# EAGLE schematic PCB - nrf52840 (EAGLE 9.6.2)
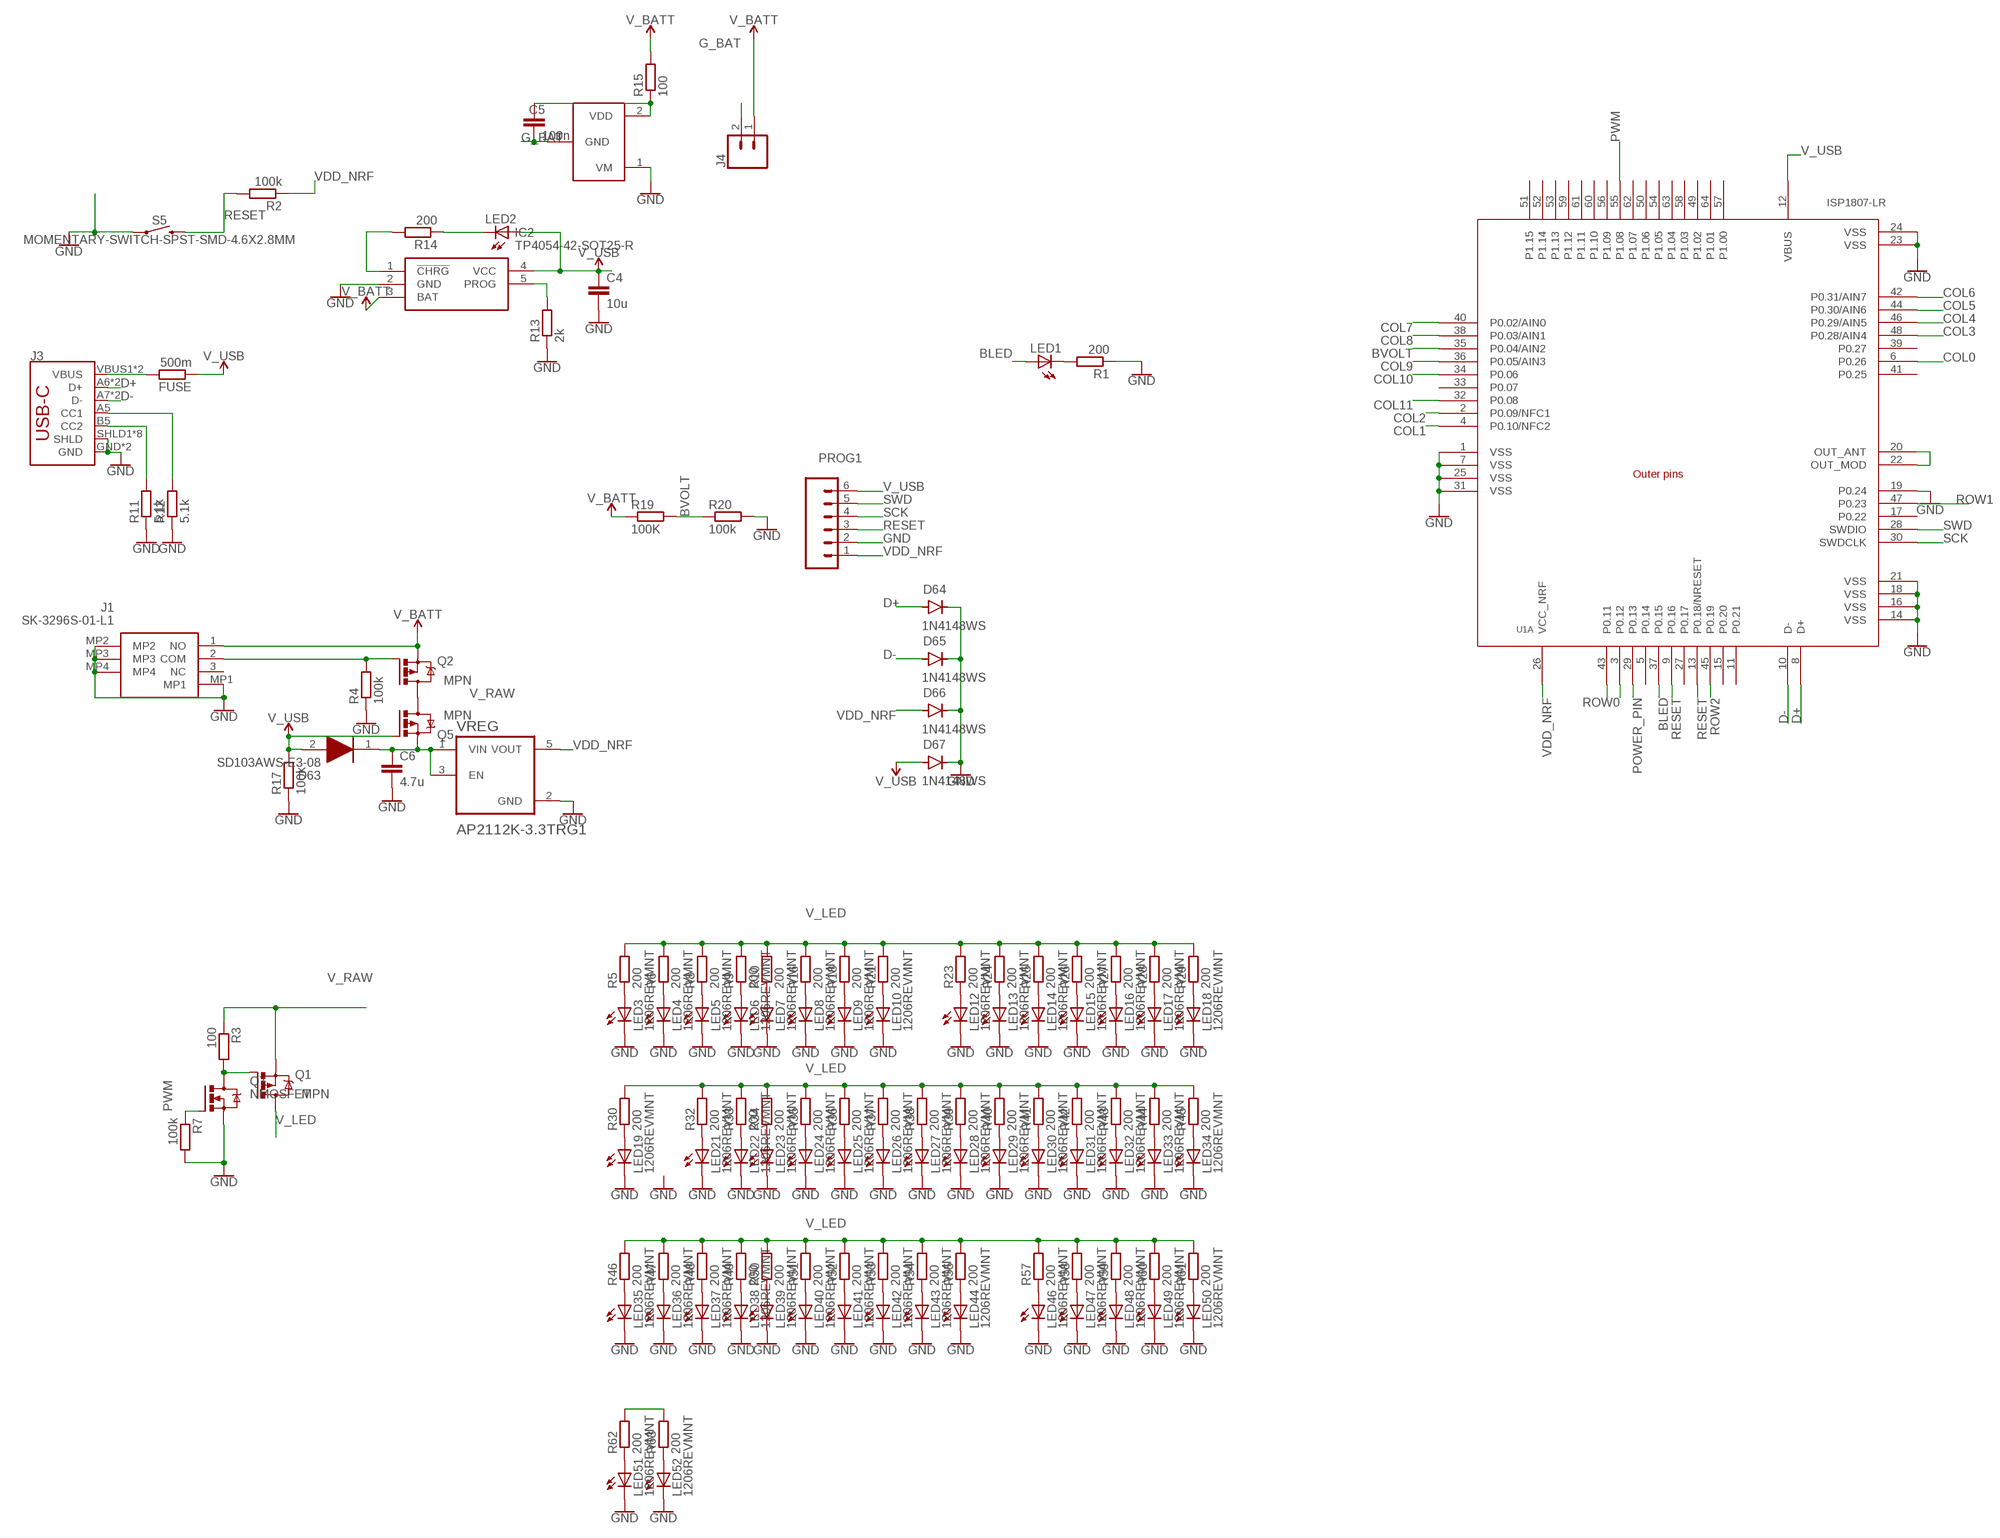
[diagram p0: schematic, sheet 1, part 1 of 2]
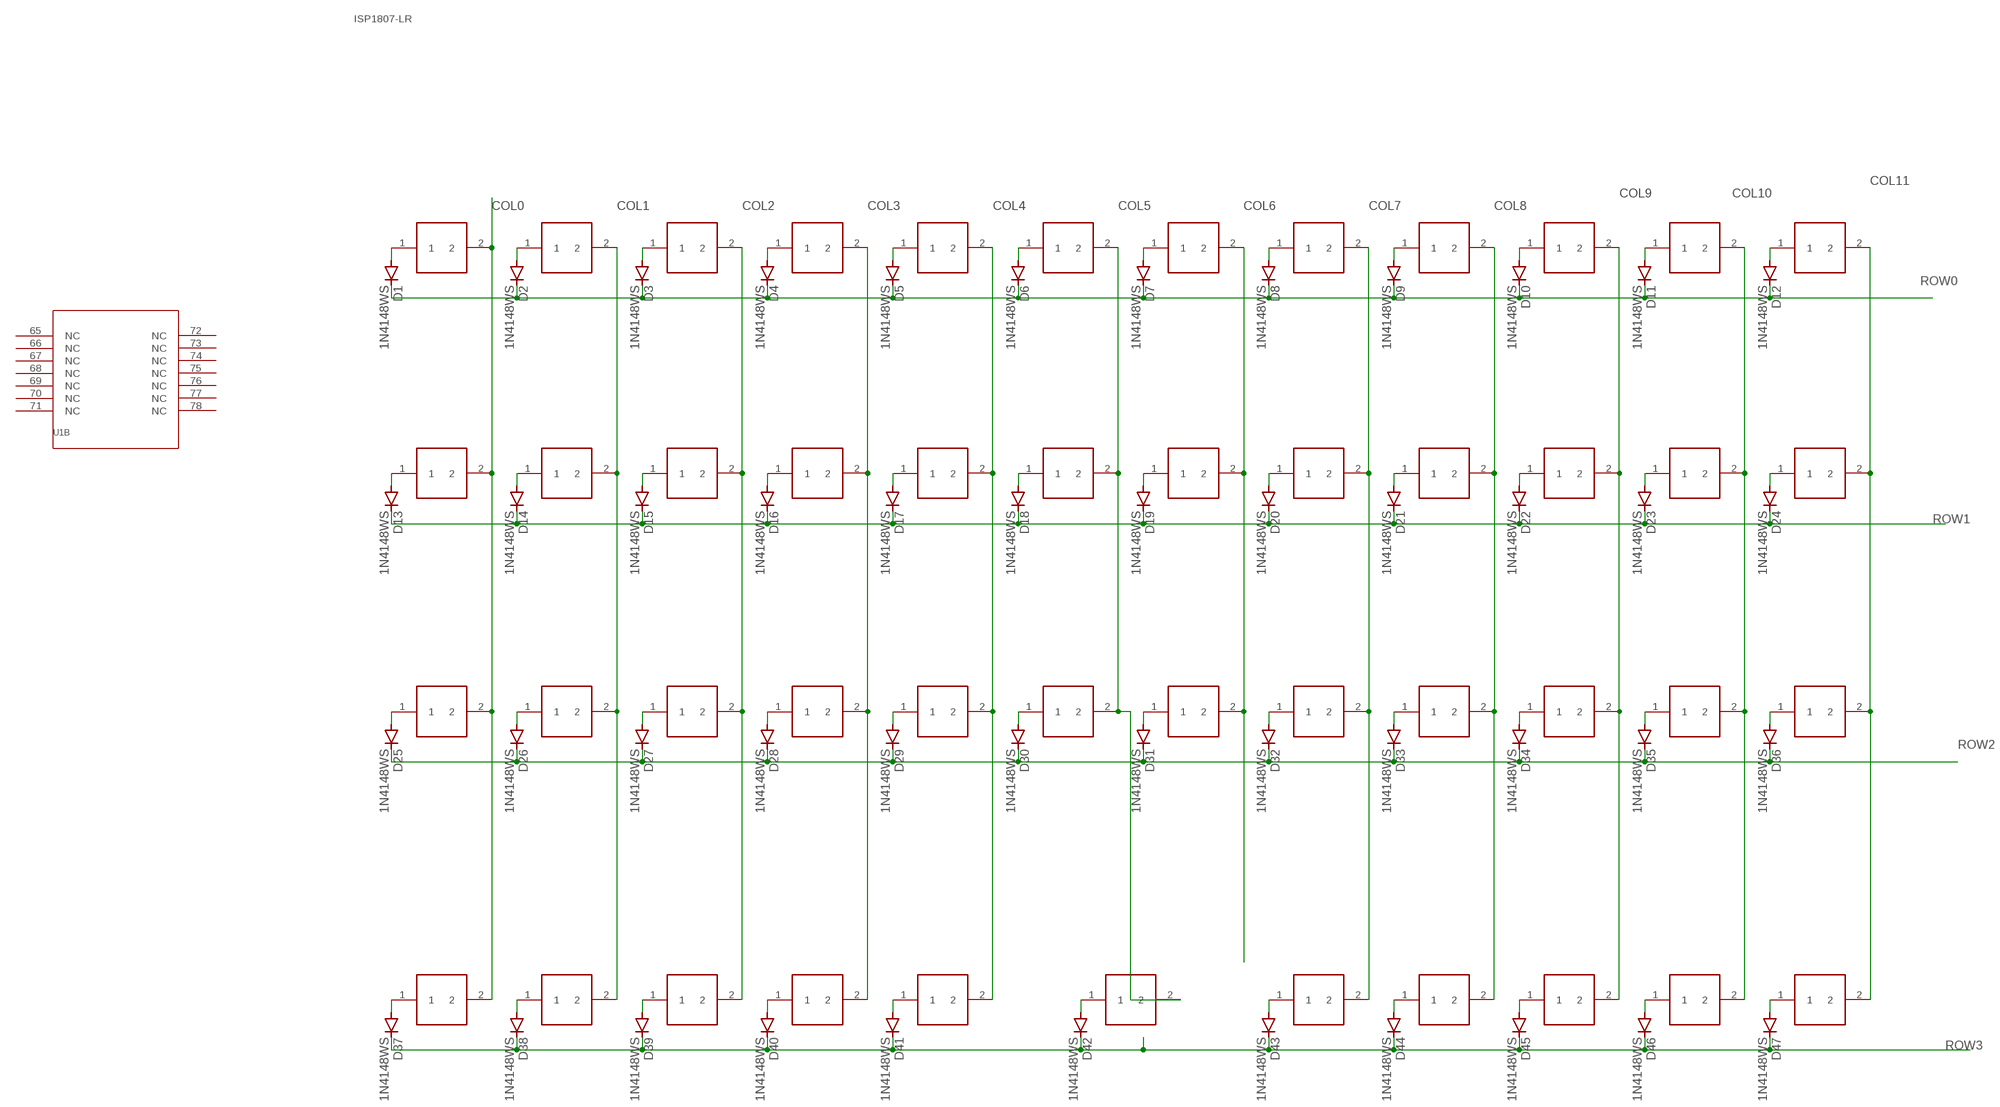
[diagram p1: schematic, sheet 1, part 2 of 2]

## Parts
5  CHERRYLOWPRO  [CHERRY-LOWPRO]
6  CHERRYLOWPRO  [CHERRY-LOWPRO]
7  CHERRYLOWPRO  [CHERRY-LOWPRO]
8  CHERRYLOWPRO  [CHERRY-LOWPRO]
12  CHERRYLOWPRO  [CHERRY-LOWPRO]
13  CHERRYLOWPRO  [CHERRY-LOWPRO]
14  CHERRYLOWPRO  [CHERRY-LOWPRO]
15  CHERRYLOWPRO  [CHERRY-LOWPRO]
16  CHERRYLOWPRO  [CHERRY-LOWPRO]
17  CHERRYLOWPRO  [CHERRY-LOWPRO]
18  CHERRYLOWPRO  [CHERRY-LOWPRO]
19  CHERRYLOWPRO  [CHERRY-LOWPRO]
21  CHERRYLOWPRO  [CHERRY-LOWPRO]
22  CHERRYLOWPRO  [CHERRY-LOWPRO]
23  CHERRYLOWPRO  [CHERRY-LOWPRO]
24  CHERRYLOWPRO  [CHERRY-LOWPRO]
25  CHERRYLOWPRO  [CHERRY-LOWPRO]
26  CHERRYLOWPRO  [CHERRY-LOWPRO]
27  CHERRYLOWPRO  [CHERRY-LOWPRO]
28  CHERRYLOWPRO  [CHERRY-LOWPRO]
29  CHERRYLOWPRO  [CHERRY-LOWPRO]
31  CHERRYLOWPRO  [CHERRY-LOWPRO]
32  CHERRYLOWPRO  [CHERRY-LOWPRO]
33  CHERRYLOWPRO  [CHERRY-LOWPRO]
34  CHERRYLOWPRO  [CHERRY-LOWPRO]
35  CHERRYLOWPRO  [CHERRY-LOWPRO]
36  CHERRYLOWPRO  [CHERRY-LOWPRO]
37  CHERRYLOWPRO  [CHERRY-LOWPRO]
38  CHERRYLOWPRO  [CHERRY-LOWPRO]
39  CHERRYLOWPRO  [CHERRY-LOWPRO]
42  CHERRYLOWPRO  [CHERRY-LOWPRO]
43  CHERRYLOWPRO  [CHERRY-LOWPRO]
44  CHERRYLOWPRO  [CHERRY-LOWPRO]
45  CHERRYLOWPRO  [CHERRY-LOWPRO]
46  CHERRYLOWPRO  [CHERRY-LOWPRO]
47  CHERRYLOWPRO  [CHERRY-LOWPRO]
48  CHERRYLOWPRO  [CHERRY-LOWPRO]
49  CHERRYLOWPRO  [CHERRY-LOWPRO]
110  CHERRYLOWPRO  [CHERRY-LOWPRO]
111  CHERRYLOWPRO  [CHERRY-LOWPRO]
210  CHERRYLOWPRO  [CHERRY-LOWPRO]
211  CHERRYLOWPRO  [CHERRY-LOWPRO]
212  CHERRYLOWPRO  [CHERRY-LOWPRO]
310  CHERRYLOWPRO  [CHERRY-LOWPRO]
311  CHERRYLOWPRO  [CHERRY-LOWPRO]
312  CHERRYLOWPRO  [CHERRY-LOWPRO]
410  CHERRYLOWPRO  [CHERRY-LOWPRO]
C4  10u  C-EUC0603  [C0603]
C5  100n  C-EUC0603  [C0603]
C6  4.7u  C-EUC0603  [C0603]
D1  1N4148WS  [SOD-323]
D2  1N4148WS  [SOD-323]
D3  1N4148WS  [SOD-323]
D4  1N4148WS  [SOD-323]
D5  1N4148WS  [SOD-323]
D6  1N4148WS  [SOD-323]
D7  1N4148WS  [SOD-323]
D8  1N4148WS  [SOD-323]
D9  1N4148WS  [SOD-323]
D10  1N4148WS  [SOD-323]
D11  1N4148WS  [SOD-323]
D12  1N4148WS  [SOD-323]
D13  1N4148WS  [SOD-323]
D14  1N4148WS  [SOD-323]
D15  1N4148WS  [SOD-323]
D16  1N4148WS  [SOD-323]
D17  1N4148WS  [SOD-323]
D18  1N4148WS  [SOD-323]
D19  1N4148WS  [SOD-323]
D20  1N4148WS  [SOD-323]
D21  1N4148WS  [SOD-323]
D22  1N4148WS  [SOD-323]
D23  1N4148WS  [SOD-323]
D24  1N4148WS  [SOD-323]
D25  1N4148WS  [SOD-323]
D26  1N4148WS  [SOD-323]
D27  1N4148WS  [SOD-323]
D28  1N4148WS  [SOD-323]
D29  1N4148WS  [SOD-323]
D30  1N4148WS  [SOD-323]
D31  1N4148WS  [SOD-323]
D32  1N4148WS  [SOD-323]
D33  1N4148WS  [SOD-323]
D34  1N4148WS  [SOD-323]
D35  1N4148WS  [SOD-323]
D36  1N4148WS  [SOD-323]
D37  1N4148WS  [SOD-323]
D38  1N4148WS  [SOD-323]
D39  1N4148WS  [SOD-323]
D40  1N4148WS  [SOD-323]
D41  1N4148WS  [SOD-323]
D42  1N4148WS  [SOD-323]
D43  1N4148WS  [SOD-323]
D44  1N4148WS  [SOD-323]
D45  1N4148WS  [SOD-323]
D46  1N4148WS  [SOD-323]
D47  1N4148WS  [SOD-323]
D63  SD103AWS-E3-08  [SOD2713X115N]
D64  1N4148WS  [SOD-323]
D65  1N4148WS  [SOD-323]
D66  1N4148WS  [SOD-323]
D67  1N4148WS  [SOD-323]
FUSE  500m  R-EU_R0603  [R0603]
IC1  XB3303ASOT23  [SOT23-3]
IC2  TP4054-42-SOT25-R  [SOT95P280X100-5N]
J1  SK-3296S-01-L1  [SK3296S01L1]
J3  SPARKFUN-CONNECTORS_USB_C16PIN  [SPARKFUN-CONNECTORS_USB-C-16P]
J4  CONN_02  [1X02]
LED1  LEDCHIPLED_0805  [CHIPLED_0805]
LED2  LEDCHIPLED_0805  [CHIPLED_0805]
LED3  1206REVMNT  [1206REVMNT]
LED4  1206REVMNT  [1206REVMNT]
LED5  1206REVMNT  [1206REVMNT]
LED6  1206REVMNT  [1206REVMNT]
LED7  1206REVMNT  [1206REVMNT]
LED8  1206REVMNT  [1206REVMNT]
LED9  1206REVMNT  [1206REVMNT]
LED10  1206REVMNT  [1206REVMNT]
LED12  1206REVMNT  [1206REVMNT]
LED13  1206REVMNT  [1206REVMNT]
LED14  1206REVMNT  [1206REVMNT]
LED15  1206REVMNT  [1206REVMNT]
LED16  1206REVMNT  [1206REVMNT]
LED17  1206REVMNT  [1206REVMNT]
LED18  1206REVMNT  [1206REVMNT]
LED19  1206REVMNT  [1206REVMNT]
LED21  1206REVMNT  [1206REVMNT]
LED22  1206REVMNT  [1206REVMNT]
LED23  1206REVMNT  [1206REVMNT]
LED24  1206REVMNT  [1206REVMNT]
LED25  1206REVMNT  [1206REVMNT]
LED26  1206REVMNT  [1206REVMNT]
LED27  1206REVMNT  [1206REVMNT]
LED28  1206REVMNT  [1206REVMNT]
LED29  1206REVMNT  [1206REVMNT]
LED30  1206REVMNT  [1206REVMNT]
LED31  1206REVMNT  [1206REVMNT]
LED32  1206REVMNT  [1206REVMNT]
LED33  1206REVMNT  [1206REVMNT]
LED34  1206REVMNT  [1206REVMNT]
LED35  1206REVMNT  [1206REVMNT]
LED36  1206REVMNT  [1206REVMNT]
LED37  1206REVMNT  [1206REVMNT]
LED38  1206REVMNT  [1206REVMNT]
LED39  1206REVMNT  [1206REVMNT]
LED40  1206REVMNT  [1206REVMNT]
LED41  1206REVMNT  [1206REVMNT]
LED42  1206REVMNT  [1206REVMNT]
LED43  1206REVMNT  [1206REVMNT]
LED44  1206REVMNT  [1206REVMNT]
LED46  1206REVMNT  [1206REVMNT]
LED47  1206REVMNT  [1206REVMNT]
LED48  1206REVMNT  [1206REVMNT]
LED49  1206REVMNT  [1206REVMNT]
LED50  1206REVMNT  [1206REVMNT]
LED51  1206REVMNT  [1206REVMNT]
LED52  1206REVMNT  [1206REVMNT]
PROG1  CONN_061.27MM  [1X06_1.27MM]
Q1  PMOSFET  PMOSFET_SOT23  [SOT23]
Q2  PMOSFET  PMOSFET_SOT23  [SOT23]
Q5  PMOSFET  PMOSFET_SOT23  [SOT23]
Q7  NMOSFET  NMOSFETSOT23  [SOT23]
R1  200  R-EU_R0603  [R0603]
R2  100k  R-EU_R0603  [R0603]
R3  100  R-EU_R0603  [R0603]
R4  100k  R-EU_R0603  [R0603]
R5  200  R-EU_R0603  [R0603]
R6  200  R-EU_R0603  [R0603]
R7  100k  R-EU_R0603  [R0603]
R8  200  R-EU_R0603  [R0603]
R9  200  R-EU_R0603  [R0603]
R10  200  R-EU_R0603  [R0603]
R11  5.1k  R-EU_R0603  [R0603]
R12  5.1k  R-EU_R0603  [R0603]
R13  2k  R-EU_R0603  [R0603]
R14  200  R-EU_R0603  [R0603]
R15  100  R-EU_R0603  [R0603]
R16  200  R-EU_R0603  [R0603]
R17  100k  R-EU_R0603  [R0603]
R18  200  R-EU_R0603  [R0603]
R19  100K  R-EU_R0603  [R0603]
R20  100k  R-EU_R0603  [R0603]
R21  200  R-EU_R0603  [R0603]
R23  200  R-EU_R0603  [R0603]
R24  200  R-EU_R0603  [R0603]
R25  200  R-EU_R0603  [R0603]
R26  200  R-EU_R0603  [R0603]
R27  200  R-EU_R0603  [R0603]
R28  200  R-EU_R0603  [R0603]
R29  200  R-EU_R0603  [R0603]
R30  200  R-EU_R0603  [R0603]
R32  200  R-EU_R0603  [R0603]
R33  200  R-EU_R0603  [R0603]
R34  200  R-EU_R0603  [R0603]
R35  200  R-EU_R0603  [R0603]
R36  200  R-EU_R0603  [R0603]
R37  200  R-EU_R0603  [R0603]
R38  200  R-EU_R0603  [R0603]
R39  200  R-EU_R0603  [R0603]
R40  200  R-EU_R0603  [R0603]
R41  200  R-EU_R0603  [R0603]
R42  200  R-EU_R0603  [R0603]
R43  200  R-EU_R0603  [R0603]
R44  200  R-EU_R0603  [R0603]
R45  200  R-EU_R0603  [R0603]
R46  200  R-EU_R0603  [R0603]
R47  200  R-EU_R0603  [R0603]
R48  200  R-EU_R0603  [R0603]
R49  200  R-EU_R0603  [R0603]
R50  200  R-EU_R0603  [R0603]
R51  200  R-EU_R0603  [R0603]
R52  200  R-EU_R0603  [R0603]
R53  200  R-EU_R0603  [R0603]
R54  200  R-EU_R0603  [R0603]
R55  200  R-EU_R0603  [R0603]
R57  200  R-EU_R0603  [R0603]
R58  200  R-EU_R0603  [R0603]
R59  200  R-EU_R0603  [R0603]
R60  200  R-EU_R0603  [R0603]
R61  200  R-EU_R0603  [R0603]
R62  200  R-EU_R0603  [R0603]
R63  200  R-EU_R0603  [R0603]
S5  MOMENTARY-SWITCH-SPST-SMD-4.6X2.8MM  [TACTILE_SWITCH_SMD_4.6X2.8MM]
U1  ISP1807-LRISP1807-LR_ISP1807-LR  [ISP1807-LR]
VREG  AP2112K-3.3TRG1  [SOT95P285X140-5N]

## Nets
BLED: LED1.A U1.37(A:P0.15)
BVOLT: R19.2 R20.1 U1.35(A:P0.04/AIN2)
COL0: 5.2 6.2 21.2 31.2 U1.6(A:P0.26)
COL1: 12.2 22.2 32.2 42.2 U1.4(A:P0.10/NFC2)
COL2: 13.2 23.2 33.2 43.2 U1.2(A:P0.09/NFC1)
COL3: 14.2 24.2 34.2 44.2 U1.48(A:P0.28/AIN4)
COL4: 15.2 25.2 35.2 45.2 U1.46(A:P0.29/AIN5)
COL5: 16.2 26.2 36.2 46.2 U1.44(A:P0.30/AIN6)
COL6: 17.2 27.2 37.2 U1.42(A:P0.31/AIN7)
COL7: 18.2 28.2 38.2 47.2 U1.40(A:P0.02/AIN0)
COL8: 19.2 29.2 39.2 48.2 U1.38(A:P0.03/AIN1)
COL9: 49.2 110.2 210.2 310.2 U1.36(A:P0.05/AIN3)
COL10: 111.2 211.2 311.2 410.2 U1.34(A:P0.06)
COL11: 7.2 8.2 212.2 312.2 U1.32(A:P0.08)
D+: D64.A J3.A6(D+) J3.B6(D+) U1.8(A:D+)
D-: D65.A J3.A7(D-) J3.B7(D-) U1.10(A:D-)
G_BAT: C5.2 IC1.3(GND) J4.2
GND: C4.2 C6.2 D64.C D65.C D66.C D67.C IC1.1(VM) IC2.2(GND) J1.MP1 J1.MP2 J1.MP3 J1.MP4 J3.GND J3.GND2(GND) J3.SHLD1(SHLD) J3.SHLD2(SHLD) J3.SHLD3(SHLD) J3.SHLD4(SHLD) J3.SHLD5(SHLD) J3.SHLD6(SHLD) J3.SHLD7(SHLD) J3.SHLD8(SHLD) LED3.2(C) LED4.2(C) LED5.2(C) LED6.2(C) LED7.2(C) LED8.2(C) LED9.2(C) LED10.2(C) LED12.2(C) LED13.2(C) LED14.2(C) LED15.2(C) LED16.2(C) LED17.2(C) LED18.2(C) LED19.2(C) LED21.2(C) LED22.2(C) LED23.2(C) LED24.2(C) LED25.2(C) LED26.2(C) LED27.2(C) LED28.2(C) LED29.2(C) LED30.2(C) LED31.2(C) LED32.2(C) LED33.2(C) LED34.2(C) LED35.2(C) LED36.2(C) LED37.2(C) LED38.2(C) LED39.2(C) LED40.2(C) LED41.2(C) LED42.2(C) LED43.2(C) LED44.2(C) LED46.2(C) LED47.2(C) LED48.2(C) LED49.2(C) LED50.2(C) LED51.2(C) LED52.2(C) PROG1.2 Q7.2(S) R1.1 R4.1 R7.2 R11.1 R12.1 R13.1 R17.1 R20.2 S5.1 S5.2 U1.1(A:VSS) U1.7(A:VSS) U1.14(A:VSS) U1.16(A:VSS) U1.18(A:VSS) U1.19(A:P0.24) U1.21(A:VSS) U1.23(A:VSS) U1.24(A:VSS) U1.25(A:VSS) U1.31(A:VSS) VREG.2(GND)
N$1: LED3.1(A) R5.1
N$2: 12.1 D2.A
N$3: 13.1 D3.A
N$4: 14.1 D4.A
N$5: 15.1 D5.A
N$6: 16.1 D6.A
N$7: 17.1 D7.A
N$8: 18.1 D8.A
N$9: 19.1 D9.A
N$10: 110.1 D10.A
N$11: 111.1 D11.A
N$12: 8.1 D12.A
N$13: 21.1 D13.A
N$14: 22.1 D14.A
N$15: 23.1 D15.A
N$16: 24.1 D16.A
N$17: 25.1 D17.A
N$18: 26.1 D18.A
N$19: 27.1 D19.A
N$20: 28.1 D20.A
N$21: 29.1 D21.A
N$22: 210.1 D22.A
N$23: 211.1 D23.A
N$24: 212.1 D24.A
N$25: 31.1 D25.A
N$26: 32.1 D26.A
N$27: 33.1 D27.A
N$28: 34.1 D28.A
N$29: 35.1 D29.A
N$30: 36.1 D30.A
N$31: 37.1 D31.A
N$32: 38.1 D32.A
N$33: 39.1 D33.A
N$34: 310.1 D34.A
N$35: 311.1 D35.A
N$36: 312.1 D36.A
N$37: LED4.1(A) R6.1
N$38: 42.1 D38.A
N$39: 43.1 D39.A
N$40: 44.1 D40.A
N$41: 45.1 D41.A
N$42: U1.20(A:OUT_ANT) U1.22(A:OUT_MOD)
N$43: 47.1 D43.A
N$44: 48.1 D44.A
N$45: 49.1 D45.A
N$46: 410.1 D46.A
N$47: 46.1 D42.A
N$48: 7.1 D47.A
N$49: 6.1 D37.A
N$50: LED1.C R1.2
N$51: LED5.1(A) R8.1
N$52: C5.1 IC1.2(VDD) R15.1
N$53: IC2.5(PROG) R13.2
N$54: LED6.1(A) R9.1
N$55: LED7.1(A) R10.1
N$56: LED8.1(A) R16.1
N$57: LED9.1(A) R18.1
N$58: LED10.1(A) R21.1
N$59: IC2.1(!CHRG) R14.2
N$60: LED2.C R14.1
N$61: Q2.3(D) Q5.3(D)
N$63: LED12.1(A) R23.1
N$64: LED13.1(A) R24.1
N$65: LED14.1(A) R25.1
N$66: LED15.1(A) R26.1
N$67: LED16.1(A) R27.1
N$68: 5.1 D1.A
N$69: LED17.1(A) R28.1
N$70: FUSE.2 J3.VBUS1(VBUS) J3.VBUS2(VBUS)
N$71: LED18.1(A) R29.1
N$72: J3.B5(CC2) R11.2
N$73: J3.A5(CC1) R12.2
N$74: LED19.1(A) R30.1
N$75: J1.2(COM) Q2.1(G) R4.2
N$77: Q1.1(G) Q7.3(D) R3.2
N$78: LED21.1(A) R32.1
N$79: LED22.1(A) R33.1
N$80: LED23.1(A) R34.1
N$81: LED24.1(A) R35.1
N$82: LED25.1(A) R36.1
N$83: LED26.1(A) R37.1
N$84: LED27.1(A) R38.1
N$85: LED28.1(A) R39.1
N$86: LED29.1(A) R40.1
N$87: LED30.1(A) R41.1
N$88: LED31.1(A) R42.1
N$89: LED32.1(A) R43.1
N$90: LED33.1(A) R44.1
N$91: LED34.1(A) R45.1
N$92: LED35.1(A) R46.1
N$93: LED36.1(A) R47.1
N$94: LED37.1(A) R48.1
N$95: LED38.1(A) R49.1
N$96: LED39.1(A) R50.1
N$97: LED40.1(A) R51.1
N$98: LED41.1(A) R52.1
N$99: LED42.1(A) R53.1
N$100: LED43.1(A) R54.1
N$101: LED44.1(A) R55.1
N$103: LED46.1(A) R57.1
N$104: LED47.1(A) R58.1
N$105: LED48.1(A) R59.1
N$106: LED49.1(A) R60.1
N$107: LED50.1(A) R61.1
N$108: LED51.1(A) R62.1
N$109: LED52.1(A) R63.1
POWER_PIN: U1.29(A:P0.13)
PWM: Q7.1(G) R7.1 U1.55(A:P1.08)
RESET: PROG1.3 R2.2 S5.3 S5.4 U1.9(A:P0.16) U1.13(A:P0.18/NRESET)
ROW0: D1.C D2.C D3.C D4.C D5.C D6.C D7.C D8.C D9.C D10.C D11.C D12.C U1.3(A:P0.12)
ROW1: D13.C D14.C D15.C D16.C D17.C D18.C D19.C D20.C D21.C D22.C D23.C D24.C U1.47(A:P0.23)
ROW2: D25.C D26.C D27.C D28.C D29.C D30.C D31.C D32.C D33.C D34.C D35.C D36.C U1.45(A:P0.19)
ROW3: D37.C D38.C D39.C D40.C D41.C D42.C D43.C D44.C D45.C D46.C D47.C U1.43(A:P0.11)
SCK: PROG1.4 U1.30(A:SWDCLK)
SWD: PROG1.5 U1.28(A:SWDIO)
V_BATT: IC2.3(BAT) J1.1(NO) J4.1 Q2.2(S) R15.2 R19.1
V_LED: Q1.3(D) R5.2 R6.2 R8.2 R9.2 R10.2 R16.2 R18.2 R21.2 R23.2 R24.2 R25.2 R26.2 R27.2 R28.2 R29.2 R30.2 R32.2 R33.2 R34.2 R35.2 R36.2 R37.2 R38.2 R39.2 R40.2 R41.2 R42.2 R43.2 R44.2 R45.2 R46.2 R47.2 R48.2 R49.2 R50.2 R51.2 R52.2 R53.2 R54.2 R55.2 R57.2 R58.2 R59.2 R60.2 R61.2 R62.2 R63.2
V_RAW: C6.1 D63.1(K) Q1.2(S) Q5.2(S) R3.1 VREG.1(VIN) VREG.3(EN)
V_USB: C4.1 D63.2(A) D67.A FUSE.1 IC2.4(VCC) LED2.A PROG1.6 Q5.1(G) R17.2 U1.12(A:VBUS)
VDD_NRF: D66.A PROG1.1 R2.1 U1.26(A:VCC_NRF) VREG.5(VOUT)
Unconnected: J1.3(NC) U1.5(A:P0.14) U1.11(A:P0.21) U1.15(A:P0.20) U1.17(A:P0.22) U1.27(A:P0.17) U1.33(A:P0.07) U1.39(A:P0.27) U1.41(A:P0.25) U1.49(A:P1.02) U1.50(A:P1.06) U1.51(A:P1.15) U1.52(A:P1.14) U1.53(A:P1.13) U1.54(A:P1.05) U1.56(A:P1.09) U1.57(A:P1.00) U1.58(A:P1.03) U1.59(A:P1.12) U1.60(A:P1.10) U1.61(A:P1.11) U1.62(A:P1.07) U1.63(A:P1.04) U1.64(A:P1.01) U1.65(B:NC) U1.66(B:NC) U1.67(B:NC) U1.68(B:NC) U1.69(B:NC) U1.70(B:NC) U1.71(B:NC) U1.72(B:NC) U1.73(B:NC) U1.74(B:NC) U1.75(B:NC) U1.76(B:NC) U1.77(B:NC) U1.78(B:NC)

## Library data of the parts
5-8 12-19 21-29 31-39 42-49 110 111 210-212 310-312 410 = Volume_V1:CHERRY
C4 C5 = resistor:C-EU: CAPACITOR, European symbol
C6 = Volume_V1:C-EU: CAPACITOR, European symbol; SPICEPREFIX: C
D1-D47 = Volume_V1:1N4148WS: DIODE GEN PURP 75V 150MA SOD323F Manufacturer's datasheet <https://www.onsemi.com/pub/Collateral/1N914BWS-D.pdf>; CREATED_BY: PCBLayout.com; DIGIKEY_PART_NUMBER: 1N4148WSFSTR-ND; MANUFACTURER: Diodes Incorporated; MPN: 1N4148WS; PACKAGE: SOD-323
D63 = Volume_V1:SD103AWS-E3-08: Vishay SD103AWS-E3-08, SMT Schottky Diode, 40V 350mA, 10ns, 2-Pin SOD-323 Source: Datasheet <http://www.vishay.com/docs/85682/sd103aws.pdf>; ARROW_PART_NUMBER: SD103AWS-E3-08; ARROW_PRICE-STOCK: https://www.arrow.com/en/products/sd103aws-e3-08/vishay; DESCRIPTION: Vishay SD103AWS-E3-08, SMT Schottky Diode, 40V 350mA, 10ns, 2-Pin SOD-323; HEIGHT: 1.15mm; MANUFACTURER_NAME: Vishay; MANUFACTURER_PART_NUMBER: SD103AWS-E3-08; MOUSER_PART_NUMBER: 78-SD103AWS-E3-08; MOUSER_PRICE-STOCK: https://www.mouser.co.uk/ProductDetail/Vishay-Semiconductors/SD103AWS-E3-08?qs=S660mHfF5o1xcba7ic5A%252BA%3D%3D
D64-D67 = Diodes:1N4148WS: DIODE GEN PURP 75V 150MA SOD323F Manufacturer's datasheet <https://www.onsemi.com/pub/Collateral/1N914BWS-D.pdf>; CREATED_BY: PCBLayout.com; DIGIKEY_PART_NUMBER: 1N4148WSFSTR-ND; MANUFACTURER: Diodes Incorporated; MPN: 1N4148WS; PACKAGE: SOD-323
FUSE R1 R2 R11-R15 R19 R20 = rcl:R-EU_: RESISTOR, European symbol; SPICEPREFIX: R
IC1 = Volume_V1:XB3303A
IC2 = TP4054-42-SOT25-R:TP4054-42-SOT25-R: Standalone Linear Li-ion Battery Charger with Thermal Regulation, SOT-23-5 Source: Datasheet <http://images.100y.com.tw/pdf_file/38-TP-TP4054x.pdf>; DESCRIPTION: Standalone Linear Li-ion Battery Charger with Thermal Regulation, SOT-23-5; HEIGHT: 1mm; MANUFACTURER_NAME: TOP POWER; MANUFACTURER_PART_NUMBER: TP4054-42-SOT25-R
J1 = Volume_V1:SK-3296S-01-L1: Toggle Switches SMD RoHS Source: Datasheet <https://datasheet.lcsc.com/szlcsc/XKB-SK-3296S-01-L1_C319020.pdf>; DESCRIPTION: Toggle Switches SMD RoHS; HEIGHT: 1.4mm; MANUFACTURER_NAME: XKB Enterprise; MANUFACTURER_PART_NUMBER: SK-3296S-01-L1
J3 = USB-C-Breakout:SPARKFUN-CONNECTORS_USB_C: USB Type C 16Pin Connector Super Speed pins not available on the 16-pin purely SMD connector so this part is best for USB 2.0 implementations. D1 and D2 are tied together enabling D+/- no matter which way the cable is plugged into the connector. The two channel configuration pins (CC1/2) are exposed. These are normally connected to ground via 5.1k resistors but can be reconfigured for high current/high power applications.; PROD_ID: CONN-14122
J4 = SparkFun-Connectors:CONN_02: Multi connection point. Often used as Generic Header-pin footprint for 0.1 inch spaced/style header connections On any of the 0.1 inch spaced packages, you can populate with these: Break Away Headers - Straight <https://www.sparkfun.com/products/116> (PRT-00116) Break Away Male Headers - Right Angle <https://www.sparkfun.com/products/553> (PRT-00553) Female Headers <https://www.sparkfun.com/products/115> (PRT-00115) Break Away Headers - Machine Pin <https://www.sparkfun.com/products/117> (PRT-00117) Break Away Female Headers - Swiss Machine Pin <https://www.sparkfun.com/products/743> (PRT-00743) For SCREWTERMINALS and SPRING TERMINALS visit here: Screw Terimnals on SparkFun.com <https://www.sparkfun.com/search/results?term=Screw+Terminals> (5mm/3.5mm/2.54mm spacing) This device is also useful as a general connection point to wire up your design to another part of your project. Our various solder wires solder well into these plated through hole pads. Hook-Up Wire - Assortment (Stranded, 22 AWG) <https://www.sparkfun.com/products/11375> (PRT-11375) Hook-Up Wire - Assortment (Solid Core, 22 AWG) <https://www.sparkfun.com/products/11367> (PRT-11367) View the entire wire category on our website here <https://www.sparkfun.com/categories/141> Special notes: Molex polarized connector foot print use with: PRT-08233 with associated crimp pins and housings. 2.54_SCREWTERM for use with PRT-10571. 3.5mm Screw Terminal footprints for PRT-08084 5mm Screw Terminal footprints for use with PRT-08432
LED1 LED2 = adafruit:LED: LED OSRAM: - CHIPLED LG R971, LG N971, LY N971, LG Q971, LY Q971, LO R971, LY R971 LH N974, LH R974 LS Q976, LO Q976, LY Q976 LO Q996 - Hyper CHIPLED LW Q18S LB Q993, LB Q99A, LB R99A - SideLED LS A670, LO A670, LY A670, LG A670, LP A670 LB A673, LV A673, LT A673, LW A673 LH A674 LY A675 LS A676, LA A676, LO A676, LY A676, LW A676 LS A679, LY A679, LG A679 - Hyper Micro SIDELED® LS Y876, LA Y876, LO Y876, LY Y876 LT Y87S - SmartLED LW L88C, LW L88S LB L89C, LB L89S, LG L890 LS L89K, LO L89K, LY L89K LS L896, LA L896, LO L896, LY L896 - TOPLED LS T670, LO T670, LY T670, LG T670, LP T670 LSG T670, LSP T670, LSY T670, LOP T670, LYG T670 LG T671, LOG T671, LSG T671 LB T673, LV T673, LT T673, LW T673 LH T674 LS T676, LA T676, LO T676, LY T676, LB T676, LH T676, LSB T676, LW T676 LB T67C, LV T67C, LT T67C, LS T67K, LO T67K, LY T67K, LW E67C LS E67B, LA E67B, LO E67B, LY E67B, LB E67C, LV E67C, LT E67C LW T67C LS T679, LY T679, LG T679 LS T770, LO T770, LY T770, LG T770, LP T770 LB T773, LV T773, LT T773, LW T773 LH T774 LS E675, LA E675, LY E675, LS T675 LS T776, LA T776, LO T776, LY T776, LB T776 LHGB T686 LT T68C, LB T68C - Hyper Mini TOPLED® LB M676 - Mini TOPLED Santana® LG M470 LS M47K, LO M47K, LY M47K Source: http://www.osram.convergy.de/
LED3-LED10 LED12-LED19 LED21-LED44 LED46-LED52 = Volume_V1:1206REVMNT
PROG1 = SparkFun-Connectors:CONN_06: Multi connection point. Often used as Generic Header-pin footprint for 0.1 inch spaced/style header connections On any of the 0.1 inch spaced packages, you can populate with these: Break Away Headers - Straight <https://www.sparkfun.com/products/116> (PRT-00116) Break Away Male Headers - Right Angle <https://www.sparkfun.com/products/553> (PRT-00553) Female Headers <https://www.sparkfun.com/products/115> (PRT-00115) Break Away Headers - Machine Pin <https://www.sparkfun.com/products/117> (PRT-00117) Break Away Female Headers - Swiss Machine Pin <https://www.sparkfun.com/products/743> (PRT-00743) Arduino Stackable Header - 6 Pin <https://www.sparkfun.com/products/9280> (PRT-09280) For SCREWTERMINALS and SPRING TERMINALS visit here: Screw Terimnals on SparkFun.com <https://www.sparkfun.com/search/results?term=Screw+Terminals> (5mm/3.5mm/2.54mm spacing) This device is also useful as a general connection point to wire up your design to another part of your project. Our various solder wires solder well into these plated through hole pads. Hook-Up Wire - Assortment (Stranded, 22 AWG) <https://www.sparkfun.com/products/11375> (PRT-11375) Hook-Up Wire - Assortment (Solid Core, 22 AWG) <https://www.sparkfun.com/products/11367> (PRT-11367) View the entire wire category on our website here <https://www.sparkfun.com/categories/141>
Q1 Q2 Q5 = Transistor:PMOSFET: P-Channel MOSFET - Generic; CATEGORY: Transistor; MPN: SL2301S; SUB-CATEGORY: MOSFET; TYPE: P-Channel
Q7 = Transistor:NMOSFET: N-Channel MOSFET - Generic; CATEGORY: Transistor; SUB-CATEGORY: MOSFET; TYPE: N-Channel
R3-R10 R16-R18 R21 R23-R30 R32-R55 R57-R63 = Volume_V1:R-EU_: RESISTOR, European symbol; SPICEPREFIX: R
S5 = Volume_V1:MOMENTARY-SWITCH-SPST: Momentary Switch (Pushbutton) - SPST Normally-open (NO) SPST momentary switches (buttons, pushbuttons). Variants PTH-12MM - 12mm square, through-hole Momentary Pushbutton Switch - 12mm Square <https://www.sparkfun.com/products/9190> (COM-09190) PTH-6.0MM, PTH-6.0MM-KIT - 6.0mm square, through-hole Mini Pushbutton Switch <https://www.sparkfun.com/products/97> (COM-00097) KIT package intended for soldering kit's - only one side of pads' copper is exposed. PTH-RIGHT-ANGLE-KIT - Right-angle, through-hole Right Angle Tactile Button <https://www.sparkfun.com/products/10791> - Used on SparkFun BigTime Watch Kit <https://www.sparkfun.com/products/11734> SMD-12MM - 12mm square, surface-mount Tactile Button - SMD (12mm) <https://www.sparkfun.com/products/12993> (COM-12993) Used on SparkFun PicoBoard <https://www.sparkfun.com/products/11888> SMD-4.5MM - 4.5mm Square Trackball Switch Used on SparkFun Blackberry Trackballer Breakout <https://www.sparkfun.com/products/13169> SMD-4.6MMX2.8MM - 4.60mm x 2.80mm, surface mount Used on SparkFun SAMD21 Mini Breakout <https://www.sparkfun.com/products/13664> SMD-5.2MM, SMD-5.2-REDUNDANT - 5.2mm square, surface-mount Mini Pushbutton Switch - SMD <https://www.sparkfun.com/products/8720> (COM-08720) Used on Arduino Pro Mini <https://www.sparkfun.com/products/11114> REDUNDANT package connects both switch circuits together SMD-6.0X3.5MM - 6.0 x 3.5mm, surface mount Momentary Reset Switch SMD <https://www.sparkfun.com/products/8229> (COM-08229) SMD-6.2MM-TALL - 6.2mm square, surface mount Tactile Button - SMD (6mm) <https://www.sparkfun.com/products/12992> Used on SparkFun Digital Sandbox <https://www.sparkfun.com/products/12651> SMD-RIGHT-ANGLE - Right-angle, surface mount Used on SparkFun Block for Intel® Edison - Arduino <https://www.sparkfun.com/products/13036>; PROD_ID: SWCH-13065
U1 = ISP1807LR_Int:ISP1807-LR: ISP Smart Bluetooth Module; BOI: QFN 8 x 8; BOI-METRIC: QFN 8 x 8; DESIG: BLE Module; FAB: Insight SiP; ISP_PART: ISP1807; REF: ISP1807-LR
VREG = Volume_V1:AP2112K-3.3TRG1: AP2112 Series 0.6 A 3.3 V Fixed Output SMT LDO Linear Regulator - SOT23-5 Check prices <https://pricing.snapeda.com/parts/AP2112K-3.3TRG1/Diodes%20Inc./view-part?ref=eda>; AVAILABILITY: Good; DESCRIPTION: Linear Voltage Regulator IC 1 Output 600mA SOT-25; MF: Diodes Inc.; MP: AP2112K-3.3TRG1; PACKAGE: SOT-753 Diodes Inc.; PRICE: None; PURCHASE-URL: https://pricing.snapeda.com/search/part/AP2112K-3.3TRG1/?ref=eda